# EAGLE design InvertedF_Antenna (EAGLE 7.7.0)
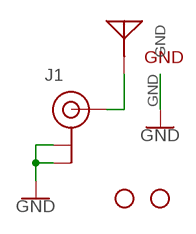
[diagram p0: schematic, sheet 1]

## Parts
H1  STAND-OFF  [STAND-OFF]
H2  STAND-OFF  [STAND-OFF]
J1  U.FL  [U.FL]
U$1  ANTENNA_915MHZ_INVERTED_F  [ANTENNA_INVERTED_F_915MHZ]

## Nets
FEED: J1.FEED(SIGNAL) U$1.FEED
GND: J1.1(GND) J1.2(GND) U$1.GND

## Library data of the parts
H1 H2 = SparkFun-Hardware:STAND-OFF: Stand Off Drill holes for mechanically mounting via screws, standoffs, etc. Note: Use the keepout ring to avoid running the screw head into surrounding components. Variant Overviews STAND-OFF - Mechanical footprint for a #4 phillips button head screw. STAND-OFF-TIGHT - Mechanical footprint for a #4 phillips button head screw, Example SparkFun Products Screw - Phillips Head (1/4", 4-40, 10 pack) <https://www.sparkfun.com/products/10453> (PRT-10453) Screw - Phillips Head (1/2", 4-40, 10 pack) <https://www.sparkfun.com/products/10452> (PRT-10452) Screw - Phillips Head (3/4", 4-40, 10 pack) <https://www.sparkfun.com/products/10451> (PRT-10451) Screw - Phillips Head (1", 4-40, 10 pack) <https://www.sparkfun.com/products/10450> (PRT-10450)
J1 = SparkFun-Connectors:U.FL: SMD Antenna Connector - U.FL 2mm height, 3.0mm x 3.0mm receptacle size. SparkFun Products: SparkFun WiFi Shield - ESP8266 <https://www.sparkfun.com/products/13287> SparkFun ESP8266 Thing <https://www.sparkfun.com/products/13231> SparkFun MiniGen - Pro Mini Signal Generator Shield <https://www.sparkfun.com/products/11420>; PROD_ID: CONN-09193; SF_ID: WRL-09144
U$1 = SparkX:ANTENNA_915MHZ_INVERTED_F

## Board
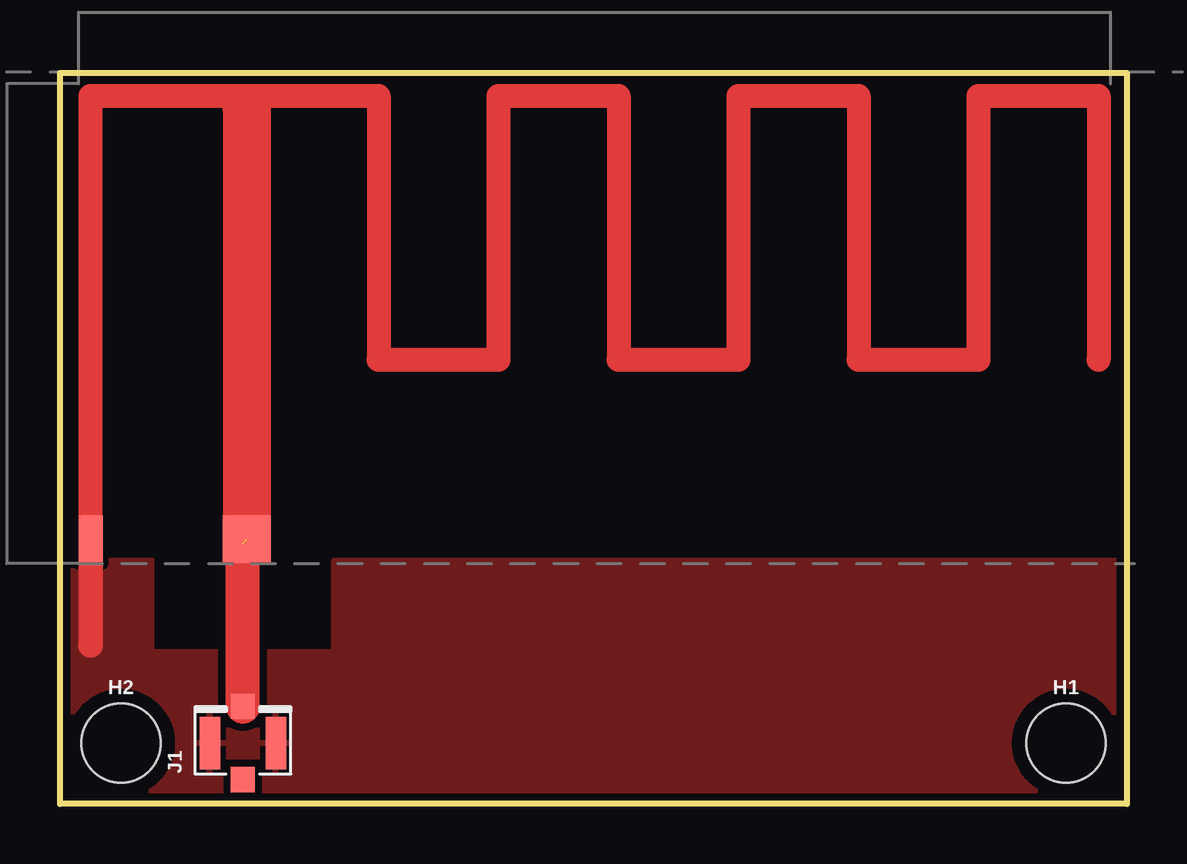
[diagram p1: board, top side]
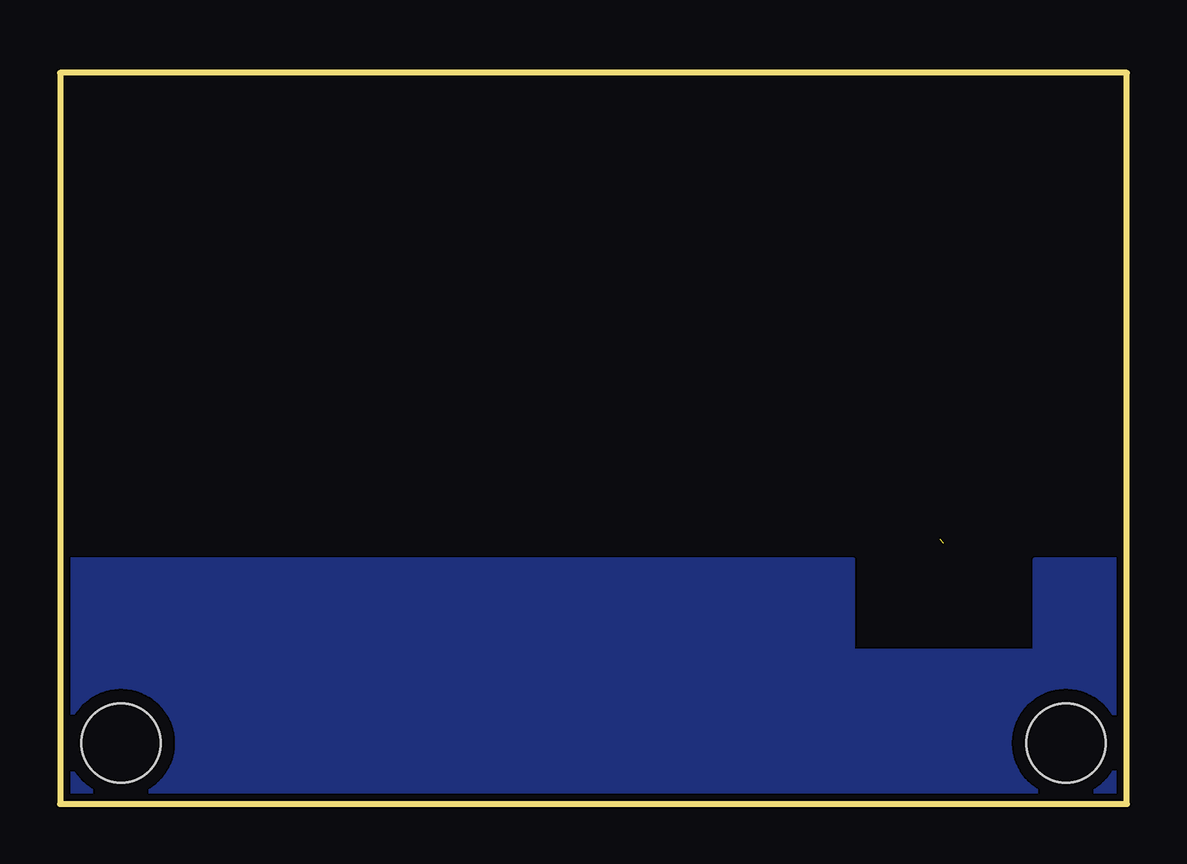
[diagram p2: board, bottom side, seen from below]

Size 44.45 x 30.48 mm. Coordinates in mm from the lower left corner, seen from the top.
Outline: 0,0 0,30.48 44.45,30.48 44.45,0 0,0
Copper layers (1*16): Top 0.035mm / dielectric 1.5mm / Bottom 0.035mm
Design rules "SparkFun-2-layer-PCBWay-LIMIT": minimum track width 6mil, minimum drill 0.3mm, track to track 6mil, track to pad 6mil, pad to pad 6mil, via to via 6mil, smd to smd 6mil, copper to edge 6mil, drill to drill 6mil, minimum pad ring 7mil, minimum via ring 7mil, stop-mask expansion 4mil, vias tented up to drill 25mil, thermal gap 10mil

### Footprints (pad centres in the part's own frame; a part is rotated, then mirrored left to right if it is on the bottom)
STAND-OFF = hole 3.302: 0,0
U.FL = smd 2.2 x 0.85: 1 0,1.375; 2 0,-1.375 | smd 1.05 x 1: FEED 1.525,0; NC -1.525,0
ANTENNA_INVERTED_F_915MHZ = smd 2 x 2: FEED 6,2 | smd 1 x 2: GND -0.5,2

### Placement (x,y rotation side)
H1  41.91,2.54 0 top
H2  2.54,2.54 0 top
J1  7.62,2.54 90 top
U$1  1.78,9.02 0 top

### Tracks (layer width: path | path; a pad name or v marks a point on that pad's centre or on a via)
FEED  (1 unrouted)
  Top 1.422: J1.FEED 7.62,10.86
GND
  Top 1.016: U$1.GND 1.28,6.61 1.27,6.6
  pour Bottom (isolate 0.305): 0,10.16 3.81,10.16 3.81,6.35 11.43,6.35 11.43,10.16 44.45,10.16 44.45,0 0,0
  pour Top (isolate 0.305): 0,10.16 3.81,10.16 3.81,6.35 11.43,6.35 11.43,10.16 44.45,10.16 44.45,0 0,0